# Altium schematic sheet SENSOR.SchDoc
size A4; SheetNumber: 6; SheetTotal: 7; SPICEModelCacheEPDGRBMA: <root> / <DocumentId>EPDGRBMA</DocumentId> / <CacheFrame Number="0"> / <Model Name="cap" Kind="MDL"> / <Text>*Default semiconductor capacitor / .MODEL CAP C()</Text> / </Model> / </CacheFrame> / </root>
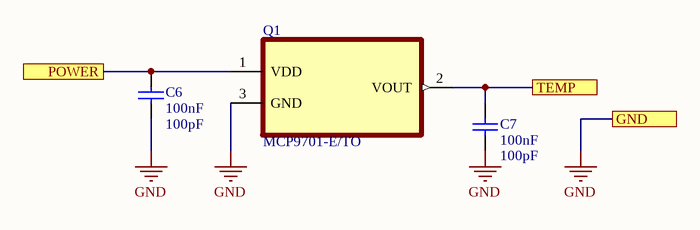
[diagram p0: SENSOR.SchDoc]

## Parts
C6  100nF  value 100pF  [RAD-0.3]
C7  100nF  value 100pF  [RAD-0.3]
Q1  MCP9701-E/TO  [TO127P254X533-3]

## Ports
GND, POWER, TEMP

## Nets
GND: C6.2 C7.2 Q1.3(GND) ; port GND
POWER: C6.1 Q1.1(VDD) ; port POWER
TEMP: C7.1 Q1.2(VOUT) ; port TEMP

## Library data of the parts
C6 C7 = Cap: Capacitor; Published: 8-Jun-2000; LatestRevisionDate: 17-Jul-2002; LatestRevisionNote: Re-released for DXP Platform.; PackageReference: RAD-0.3; Publisher: Altium Limited; PackageDescription: Radial Cap, Thru-Hole; 2 Leads; 0.3 in Pin Spacing
Q1 = MCP9701-E/TO: 3 TO-92 4x4mm BAG, Linear Active Thermister (TM) IC (19.53mV/oC) | Microchip Technology Inc. MCP9701-E/TO; SnapEDA_Link: https://www.snapeda.com/parts/MCP9701-E/TO/Microchip/view-part/?ref=snap; Package: TO-92 Microchip; Value: *; MF: Microchip Technology; MP: MCP9701-E/TO; Check_prices: https://www.snapeda.com/parts/MCP9701-E/TO/Microchip/view-part/?ref=eda